# EAGLE schematic W076-3-20 (EAGLE 6.6.0)
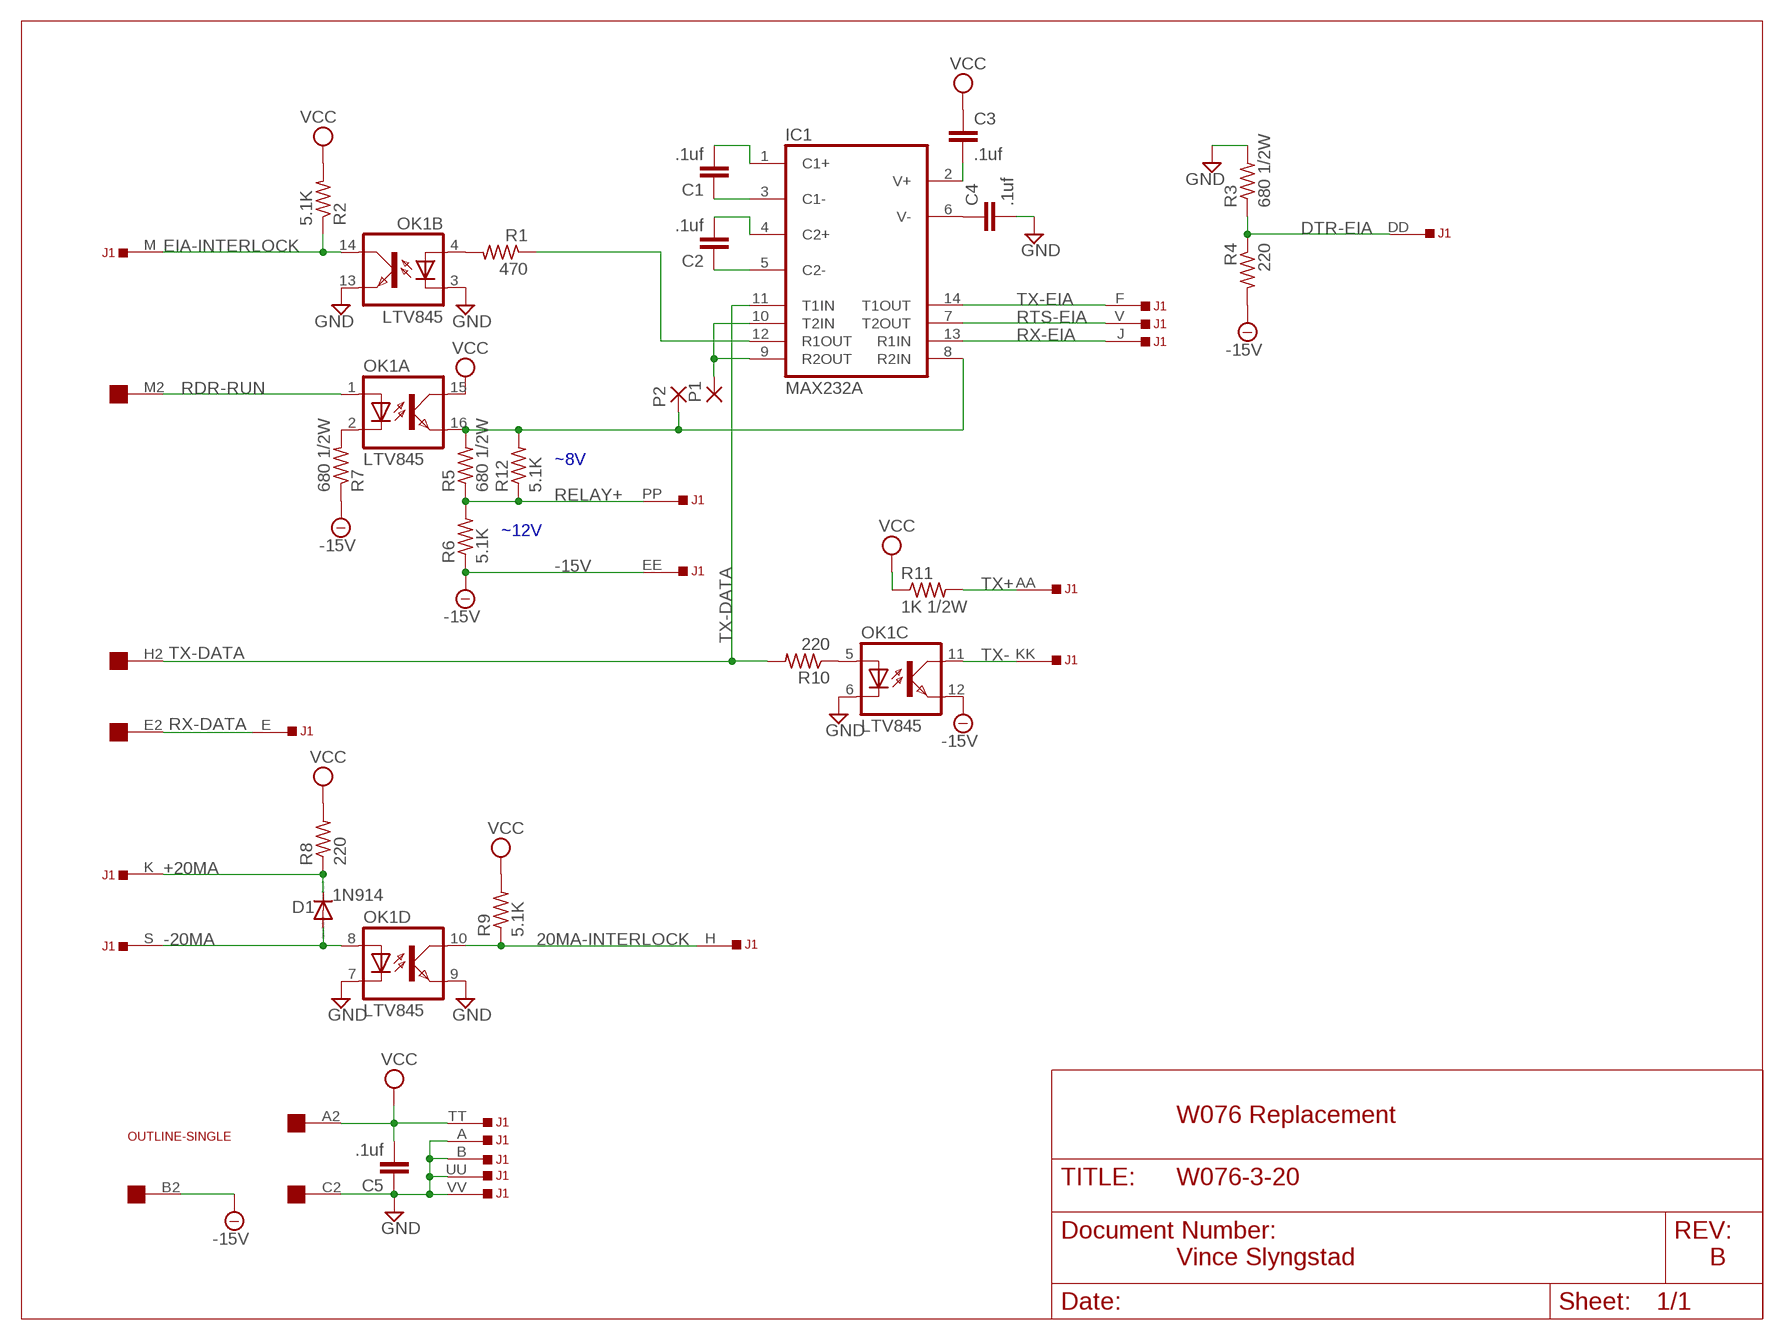
[diagram p0: schematic, sheet 1]

## Parts
C1  .1uf  C-EU050-025X075  [C050-025X075]
C2  .1uf  C-EU050-025X075  [C050-025X075]
C3  .1uf  C-EU050-025X075  [C050-025X075]
C4  .1uf  C-EU050-025X075  [C050-025X075]
C5  .1uf  C-EU050-025X075  [C050-025X075]
D1  1N914  1N4004  [DO41-10]
IC1  MAX232A  MAX232  [DIL16]
J1  DEC40PINSH  [DEC40PINH]
OK1  LTV845  ILQ1  [DIL16]
P1  1,6/0,8  [1,6/0,8]
P2  1,6/0,8  [1,6/0,8]
R1  470  R-US_0207/10  [0207/10]
R2  5.1K  R-US_0207/10  [0207/10]
R3  680 1/2W  R-US_0207/12  [0207/12]
R4  220  R-US_0207/10  [0207/10]
R5  680 1/2W  R-US_0207/12  [0207/12]
R6  5.1K  R-US_0207/10  [0207/10]
R7  680 1/2W  R-US_0207/12  [0207/12]
R8  220  R-US_0207/10  [0207/10]
R9  5.1K  R-US_0207/10  [0207/10]
R10  220  R-US_0207/10  [0207/10]
R11  1K 1/2W  R-US_0207/10  [0207/10]
R12  5.1K  R-US_0207/10  [0207/10]
U$2  EDGE-1  [EDGE-CON1]
U$3  OUTLINE-SINGLE  [SINGLE]

## Nets
20MA-INTERLOCK: J1.H OK1.10(D:COL) R9.1
+20MA: D1.C J1.K R8.1
-15V [supply]: J1.EE OK1.12(C:EMIT) R4.2 R6.1 R7.1 U$2.B2
-20MA: D1.A J1.S OK1.8(D:A)
DTR-EIA: J1.DD R3.1 R4.1
EIA-INTERLOCK: J1.M OK1.14(B:COL) R2.1
GND [supply]: C4.2 C5.1 J1.A J1.B J1.UU J1.VV OK1.3(B:C) OK1.6(C:C) OK1.7(D:C) OK1.9(D:EMIT) OK1.13(B:EMIT) R3.2 U$2.C2
N$1: C2.1 IC1.5(C2-)
N$2: C2.2 IC1.4(C2+)
N$3: C1.2 IC1.1(C1+)
N$4: C1.1 IC1.3(C1-)
N$5: OK1.2(A:C) R7.2
N$6: IC1.9(R2OUT) IC1.10(T2IN) P1.1(P)
N$7: IC1.8(R2IN) OK1.16(A:EMIT) P2.1(P) R5.2 R12.2
N$8: IC1.12(R1OUT) R1.1
N$9: C3.2 IC1.2(V+)
N$10: C4.1 IC1.6(V-)
N$11: OK1.4(B:A) R1.2
N$15: OK1.5(C:A) R10.1
RDR-RUN: OK1.1(A:A) U$2.M2
RELAY+: J1.PP R5.1 R6.2 R12.1
RTS-EIA: IC1.7(T2OUT) J1.V
RX-DATA: J1.E U$2.E2
RX-EIA: IC1.13(R1IN) J1.J
TX+: J1.AA R11.2
TX-: J1.KK OK1.11(C:COL)
TX-DATA: IC1.11(T1IN) R10.2 U$2.H2
TX-EIA: IC1.14(T1OUT) J1.F
VCC [supply]: C3.1 C5.2 J1.TT OK1.15(A:COL) R2.2 R8.2 R9.2 R11.1 U$2.A2
Unconnected: J1.BB J1.C J1.CC J1.D J1.FF J1.HH J1.JJ J1.L J1.LL J1.MM J1.N J1.NN J1.P J1.R J1.RR J1.SS J1.T J1.U J1.W J1.X J1.Y J1.Z U$2.D2 U$2.F2 U$2.J2 U$2.K2 U$2.L2 U$2.N2 U$2.P2 U$2.R2 U$2.S2 U$2.T2 U$2.U2 U$2.V2

## Notes on the sheet
- ~8V
- ~12V
- W076 Replacement
- Vince Slyngstad | B

## Power pins joined to a net without a drawn wire
GND: IC1.15(GND)
VCC: IC1.16(VCC)

## Library data of the parts
C1-C5 = rcl:C-EU: CAPACITOR, European symbol
D1 = diode:1N4004: DIODE general purpose rectifier, 1 A
IC1 = maxim:MAX232: RS232 TRANSCEIVER; MF: MAXIM; MPN: MAX232ACPE+; OC_FARNELL: 9723773; OC_NEWARK: 68K4544
J1 = dec-con:DEC40PINS: 40 pin ribbon connector for BC08, BC11 cables.
OK1 = optocoupler:ILQ1: SIEMENS OPTO COUPLER; MF: VISHAY/TELEFUNKEN; MPN: ILQ1; OC_FARNELL: 1469501; OC_NEWARK: 88K1954
P1 P2 = wirepad:1,6/0,8: THROUGH-HOLE PAD
R1-R12 = rcl:R-US_: RESISTOR, American symbol
U$2 = dec-con:EDGE-1: Single-Sided DEC Edge Connector -- (side 2)
U$3 = dec-con:OUTLINE-*: Board outlines for DEC boards.

## Net classes
1 supply: width 0.813 mm